# EAGLE schematic ltc4063-test (EAGLE 9.4.0)
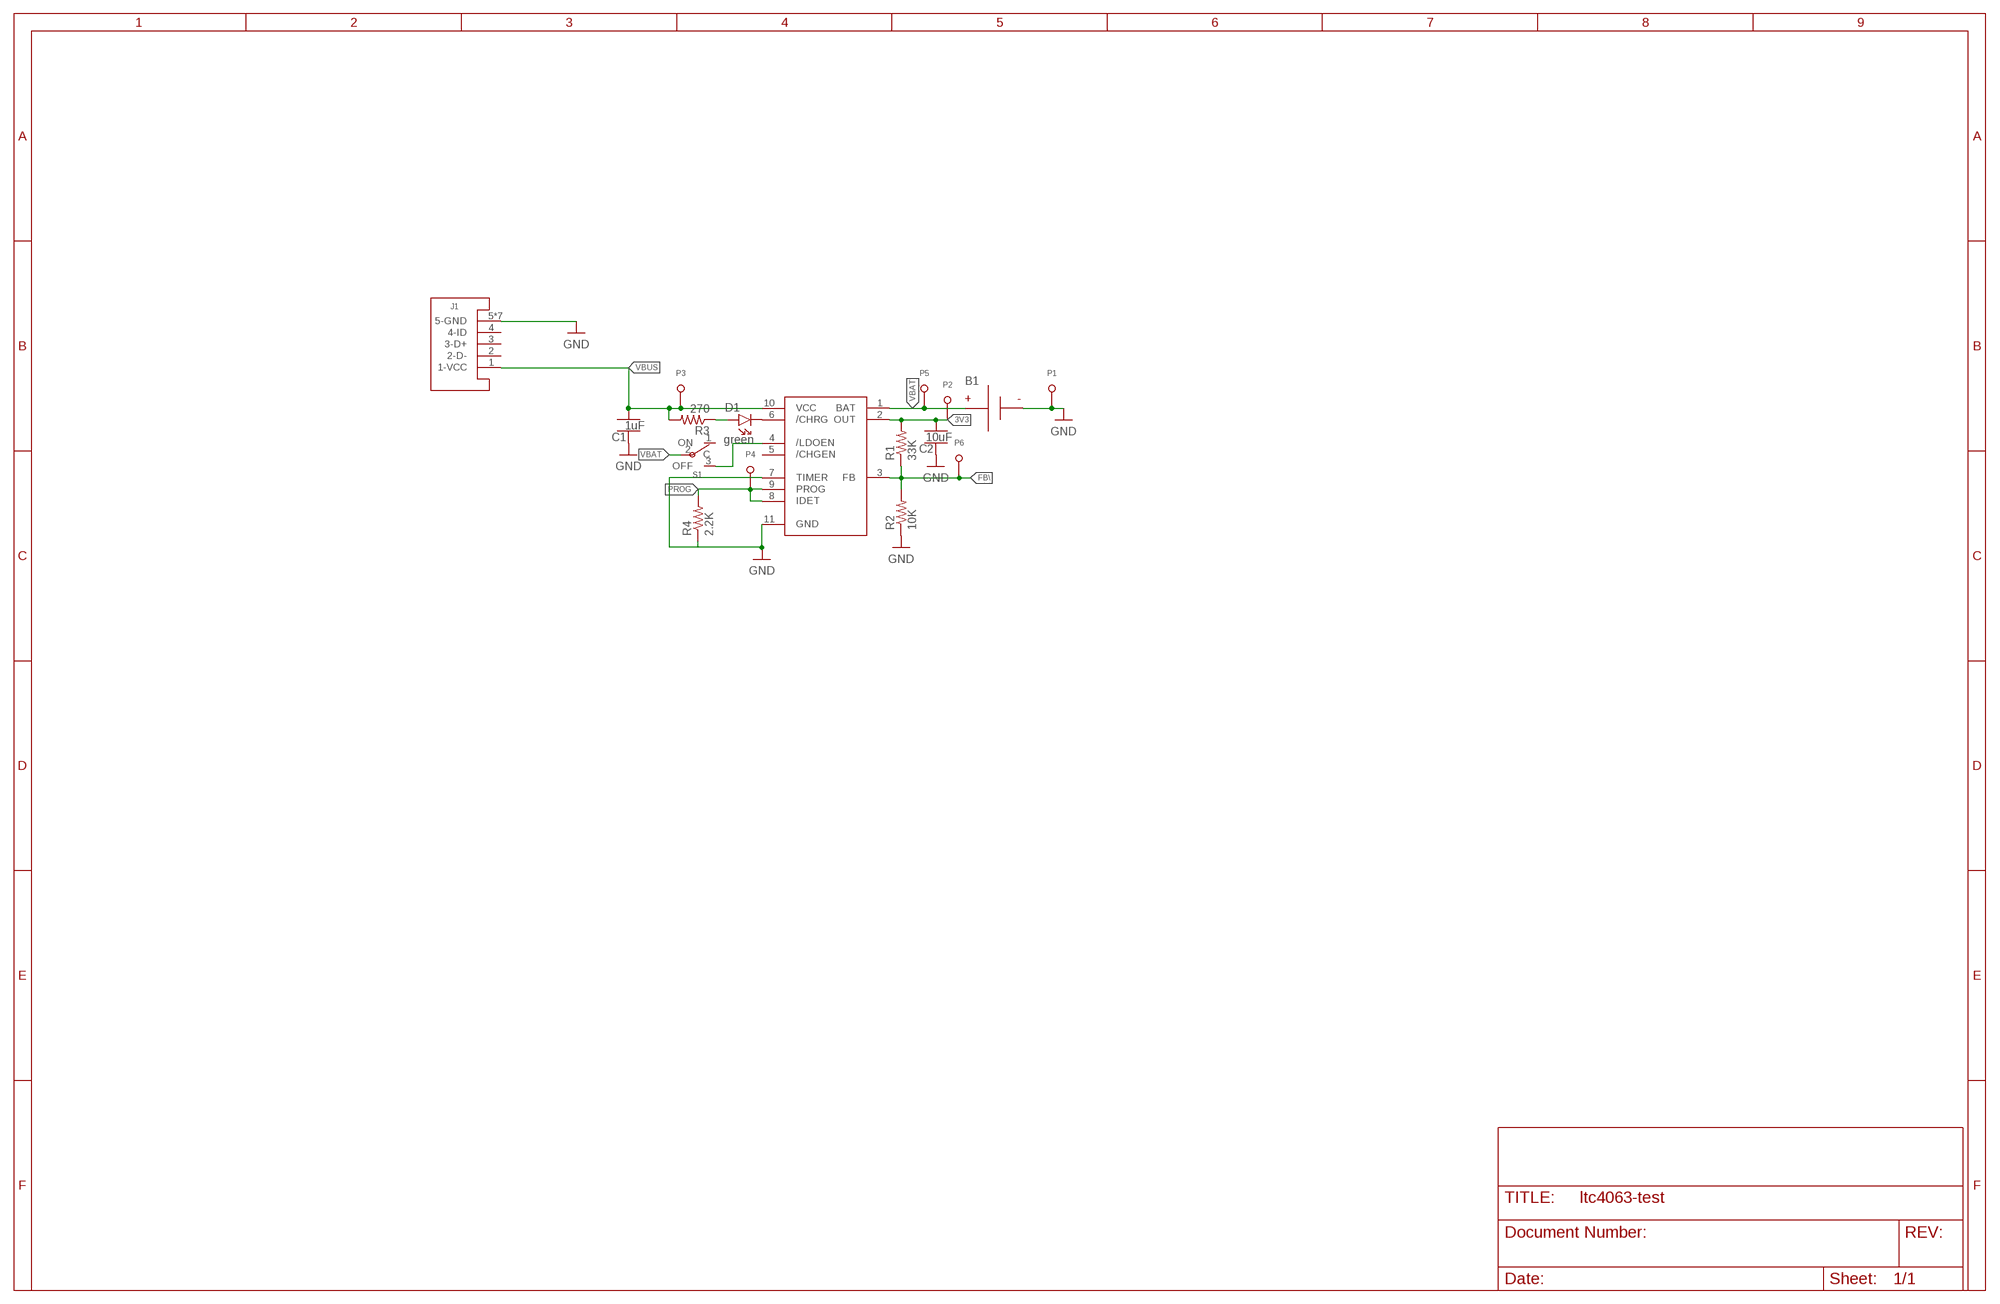
[diagram p0: schematic, sheet 1]
FRAME1 (FRAME_B_L): CREATOR: Unknown; DIST: Unknown; DISTPN: Unknown

## Parts
B1  BATTERY-SPRING-SMD  [WIRE-TERMINAL-1X2-2.5MM-SMD-AVX-009276002021106]
C1  1uF  CAPACITOR-NP_SMD-2012-0805_CERAMIC-1UF  [CAPC2012X140_HS]
C2  10uF  CAPACITOR-NP_SMD-2012-0805_CERAMIC-10UF  [CAPC2012X140_HS]
D1  green  DIODE-LED_SMD-2012-0805-GREEN  [LEDSC125X200X120-2_HS]
J1  USB-MICROA-AMPHENOL-10118192-0001LF  [USB-MICROA-10118192-0001LF]
P1  TEST-POINT  [TEST-POINT-KEYSTONE-5000]
P2  TEST-POINT  [TEST-POINT-KEYSTONE-5000]
P3  TEST-POINT  [TEST-POINT-KEYSTONE-5000]
P4  TEST-POINT  [TEST-POINT-KEYSTONE-5000]
P5  TEST-POINT  [TEST-POINT-KEYSTONE-5000]
P6  TEST-POINT  [TEST-POINT-KEYSTONE-5000]
R1  33K  RESISTOR_SMD-2012-0805-33K  [RESC2012X60_HS]
R2  10K  RESISTOR_SMD-2012-0805-10K  [RESC2012X60_HS]
R3  270  RESISTOR_SMD-2012-0805-270  [RESC2012X60_HS]
R4  2.2K  RESISTOR_SMD-2012-0805-2.2K  [RESC2012X60_HS]
S1  POWER-SWITCH-MFS201N-9-Z-SMD-VERTICAL  [JS102011JCQN]
U1  LIPO-VREG-LTC4063  [SON50P300X300X80-11T165X238]

## Nets
3V3 [HIGH-I]: C2.2 P2.T R1.2 U1.2(OUT)
FB\: P6.T R1.1 R2.2 U1.3(FB)
GND: B1.2A(N) B1.2B(N) C1.1 C2.1 J1.5(5-GND) J1.6(5-GND) J1.7(5-GND) J1.8(5-GND) J1.9(5-GND) J1.10(5-GND) J1.11(5-GND) P1.T R2.1 R4.1 U1.7(TIMER) U1.11(GND)
N$1: S1.3(OFF) U1.4(/LDOEN)
N$5: D1.C U1.6(/CHRG)
N$6: D1.A R3.1
PROG: P4.T R4.2 U1.8(IDET) U1.9(PROG)
VBAT [HIGH-I]: B1.1A(P) B1.1B(P) P5.T S1.2(C) U1.1(BAT)
VBUS [HIGH-I]: C1.2 J1.1(1-VCC) P3.T R3.2 U1.10(VCC)
Unconnected: J1.2(2-D-) J1.3(3-D+) J1.4(4-ID) S1.1(ON) U1.5(/CHGEN)

## Library data of the parts
B1 = quadparts_prebuilt:BATTERY: Connections for a battery.; CREATOR: Swanson; DIST: DIGIKEY; DISTPN: 478-6169-1-ND; MOUNTING: SMD; PIN1: +; PIN2: -
C1 = quadparts_prebuilt:CAPACITOR-NP_: Nonpolarized capacitor; CREATOR: Swanson; DIST: Digikey; DISTPN: 587-1281-1-ND; MFR: Taiyo Yuden; MOUNTING: SMD; MPN: TMK212B7105KG-T; REVIEWER: Swanson
C2 = quadparts_prebuilt:CAPACITOR-NP_: Nonpolarized capacitor; CREATOR: Swanson; DIST: Digikey; DISTPN: 445-5984-1-ND; MOUNTING: SMD; REVIEWER: Swanson
D1 = quadparts_prebuilt:DIODE-LED_: Light emitting diode; CREATOR: Swanson; DIST: Digikey; DISTPN: 160-1179-1-ND; MFR: Lite-On Inc; MOUNTING: SMD; MPN: LTST-C170GKT; REVIEWER: Swanson
J1 = RemoteParts:USB; CREATOR: Swanson; DIST: DIGIKEY; DISTPN: 609-4613-1-ND; MOUNTING: SMD
P1-P6 = RemoteParts:TEST-POINT; CREATOR: Swanson; DIST: DIGIKEY; DISTPN: 36-5001-ND; MOUNTING: TH
R1 = quadparts_prebuilt:RESISTOR_: Resistor; CREATOR: SWANSON; DIST: DIGIKEY; DISTPN: YAG3726CT-ND; MOUNTING: SMD
R2 = quadparts_prebuilt:RESISTOR_: Resistor; CREATOR: Swanson; DIST: Digikey; DISTPN: 311-10KARCT-ND; MFR: Yageo; MOUNTING: SMD; MPN: RC0805JR-0710KL; REVIEWER: Swanson
R3 = quadparts_prebuilt:RESISTOR_: Resistor; CREATOR: SWANSON; DIST: DIGIKEY; DISTPN: 311-270ARCT-ND; MOUNTING: SMD
R4 = quadparts_prebuilt:RESISTOR_: Resistor; CREATOR: SWANSON; DIST: DIGIKEY; DISTPN: YAG3776CT-ND; MOUNTING: SMD
S1 = RemoteParts:POWER-SWITCH-MFS201N-9-Z; CREATOR: Swanson; DIST: DIGIKEY; DISTPN: CKN10721CT-ND; MOUNTING: SMD
U1 = RemoteParts:LIPO-VREG-LTC4063; CREATOR: Swanson; DIST: DIGIKEY; DISTPN: LTC4063EDD#PBF-ND; MOUNTING: SMD

## Net classes
1 HIGH-I: width 0.254 mm, drill 0.178 mm